# EAGLE schematic MP2565_dev_v1 (EAGLE 9.6.0)
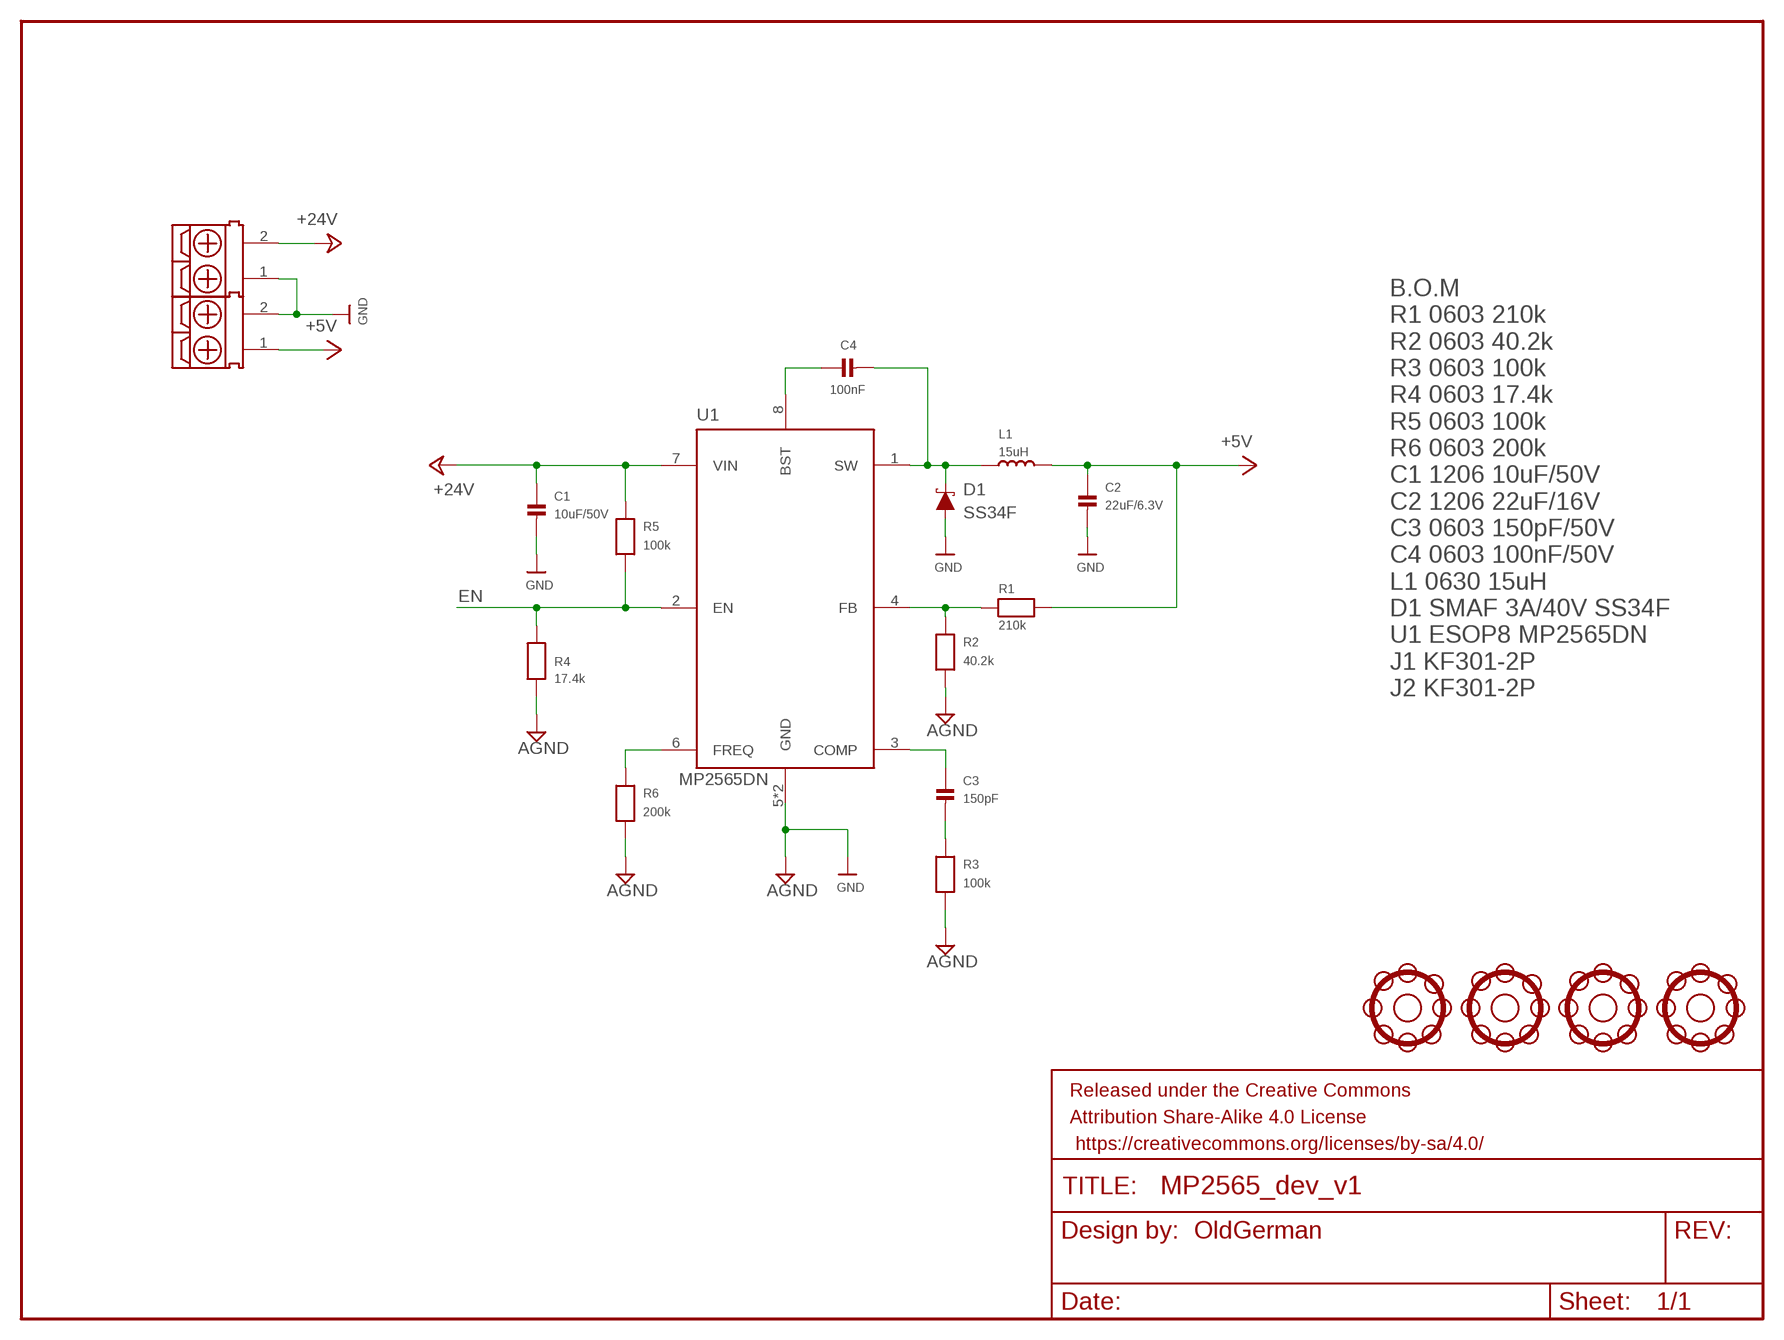
[diagram p0: schematic, sheet 1]

## Parts
C1  10uF/50V  CAP_CERAMIC1206  [1206]
C2  22uF/6.3V  CAP_CERAMIC1206  [1206]
C3  150pF  CAP_CERAMIC0603  [0603]
C4  100nF  CAP_CERAMIC0603  [0603]
D1  SS34F  [SMAF]
FRAME1  FRAME-LETTER  [CREATIVE_COMMONS]
J1  KF301_2P-5.0MM  [KF301__2P-5.0MM]
J2  KF301_2P-5.0MM  [KF301__2P-5.0MM]
L1  15uH  INDUCTOR'0630'  [L0630]
R1  210k  RESISTOR0603  [0603]
R2  40.2k  RESISTOR0603  [0603]
R3  100k  RESISTOR0603  [0603]
R4  17.4k  RESISTOR0603  [0603]
R5  100k  RESISTOR0603  [0603]
R6  200k  RESISTOR0603  [0603]
U1  MP2565DN  [ESOP8L-1.27-5X3.9MM]
U$13  SUN_HOLE_M3  [SUN_HOLE_M3]
U$14  SUN_HOLE_M3  [SUN_HOLE_M3]
U$15  SUN_HOLE_M3  [SUN_HOLE_M3]
U$16  SUN_HOLE_M3  [SUN_HOLE_M3]

## Nets
+5V: C2.1 J2.1 L1.2 R1.2
+24V: C1.1 J1.2 R5.2 U1.7(VIN)
EN: R4.1 R5.1 U1.2(EN)
GND: C1.2 C2.2 D1.A J1.1 J2.2 R2.1 R3.1 R4.2 R6.1 U1.5(GND) U1.PAD(GND) ; supply symbol labelled AGND
N$1: C4.2 D1.C L1.1 U1.1(SW)
N$2: C4.1 U1.8(BST)
N$3: R1.1 R2.2 U1.4(FB)
N$4: C3.2 R3.2
N$6: R6.2 U1.6(FREQ)
N$8: C3.1 U1.3(COMP)

## Notes on the sheet
- B.O.M
  R1 0603 210k
  R2 0603 40.2k
  R3 0603 100k
  R4 0603 17.4k
  R5 0603 100k
  R6 0603 200k
  C1 1206 10uF/50V
  C2 1206 22uF/16V
  C3 0603 150pF/50V
  C4 0603 100nF/50V
  L1 0630 15uH
  D1 SMAF 3A/40V SS34F
  U1 ESOP8 MP2565DN
  J1 KF301-2P
  J2 KF301-2P
- OldGerman

## Library data of the parts
C1-C4 = microbuilder:CAP_CERAMIC: Ceramic Capacitors 0402 - 0402 Surface Mount Capacitors 16pF 50V 5% [Digikey: 445-4899-2-ND] 18pF 50V 5% [Digikey: 490-1281-2-ND] 22pF 50V 5% [Digikey: 490-1283-2-ND] 68pF 50V 5% [Digikey: 490-1289-2-ND] 0.1uF 10V 10% [Digikey: 490-1318-2-ND] 1.0uF 6.3V 10% [Digikey: 490-1320-2-ND] 0603 - 0603 Surface Mount Capacitors 16 pF 50V 5% [Digikey: 445-5051-2-ND] 22 pF 50V [Digikey: PCC220ACVTR-ND] 33 pF 50V 5% [Digikey: 490-1415-1-ND] 56pF 50V 5% [Digikey: 490-1421-1-ND] 220pF 50V 5% [Digikey: 445-1285-1-ND] 680 pF 50V 2200 pF 50V 5% C0G [Digikey: 445-1297-1-ND] 5600 pF 100V 5% X7R [Digikey: 478-3711-1-ND] 0.1 µF 25V 10% [Digikey: PCC2277TR-ND] 0.22 µF 16V 10% X7R [Digikey: 445-1318-1-ND] 1.0 µF 25V 10% [Digikey: 445-5146-2-ND] 0603 - RF Specific 3pF 250V +/-0.1pF RF [Digikey: 712-1347-1-ND] 18 pF 250V 5% [Digikey: 478-3505-1-ND or 712-1322-1-ND] 56 pF 250V 5% C0G RF [Digikey: 490-4867-1-ND] 68 pF 250V RF [Digikey: 490-4868-1-ND] 0805 - 0805 Surface Mount Capacitors 220 pF 250V 2% RF Ceramic Capacitor [Digikey: 712-1398-1-ND] 1000 pF 50V 2% NP0 Ceramic Capacitor [Digikey: 478-3760-1-ND] 0.1 µF 25V 10% Ceramic Capacitor [Digikey: PCC1828TR-ND] 1.0 µF 16V 10% Ceramic Capacitor[Digikey: 490-1691-2-ND] 10.0 µF 10V 10% Ceramic Capacitor[Digikey: 709-1228-1-ND] 10.0 uF 16V 10% Ceramic Capacitor [Digikey: 478-5165-2-ND] 47 uF 6.3V 20% Ceramic Capacitor [Digikey: 587-1779-1-ND or 399-5506-1-ND] 1206 - 1206 Surface Mount Capacitors 47uF 10V 20% Ceramic Capacitor [Digikey: 490-5528-1-ND or 399-5508-1-ND or 445-6010-1-ND] 100uF 6.3V -20%, +80% Y5V Ceramic Capacitor (Digikey: 490-4512-1-ND, Mouser: 81-GRM31CF50J107ZE1L)
D1 = DIP:SS34F
FRAME1 = SparkFun-Aesthetics:FRAME-LETTER: Schematic Frame - Letter Standard 8.5x11 US Letter frame
J1 J2 = DIP:KF301_2P-5.0MM
L1 = DIP:INDUCTOR
R1-R6 = microbuilder:RESISTOR: Resistors 0402 - 0402 Surface Mount Package 22 Ohm 1% 1/16W [Digikey: 311-22.0LRTR-ND] 33 Ohm 5% 1/16W 1.0K 5% 1/16W 1.5K 5% 1/16W 2.0K 1% 1/16W 10.0K 1% 1/16W [Digikey: 311-10.0KLRTR-ND] 10.0K 5% 1/16W [Digikey: RMCF0402JT10K0TR-ND] 12.1K 1% 1/16W [Digikey: 311-22.0LRTR-ND] 100.0K 5% 1/16W 0603 - 0603 Surface Mount Package 0 Ohm 1/10 Watt 1% Resistor 15 Ohm 1/10 Watt 1% Resistor 33 Ohm 1/10 Watt 1% Resistor 49.9 Ohm 1/10 Watt 1% Resistor 100 Ohm 1/10 Watt 1% Resistor 150 Ohm 1/10 Watt 1% Resistor 240 Ohm 1/10 Watt 1% Resistor 390 Ohm 1/10 Watt 1% Resistor 560 Ohm 1/10 Watt 1% Resistor 680 Ohm 1/10 Watt 1% Resistor 750 Ohm 1/10 Watt 1% Resistor 1.0K Ohm 1/10 Watt 1% Resistor 1.5K Ohm 1/10 Watt 1% Resistor 2.0K Ohm 1/10 Watt 1% Resistor 2.2K Ohm 1/10 Watt 1% Resistor 3.3K Ohm 1/10 Watt 1% Resistor 4.7K Ohm 1/10 Watt 1% Resistor 10.0K Ohm 1/10 Watt 1% Resistor 12.0K Ohm 1/10 Watt 1% Resistor 12.1K Ohm 1/10 Watt 1% Resistor 20.0K Ohm 1/10 Watt 1% Resistor 33.0K Ohm 1/10 Watt 1% Resistor 100.0K Ohm 1/10 Watt 1% Resistor 0805 - 0805 Surface Mount Package 0 Ohm 1/8 Watt 1% Resistor 33 Ohm 1/8 Watt 1% Resistor 100 Ohm 1/8 Watt 1% Resistor 150 Ohm 1/8 Watt 1% Resistor 200 Ohm 1/8 Watt 1% Resistor 240 Ohm 1/8 Watt 1% Resistor 330 Ohm 1/8 Watt 1% Resistor 390 Ohm 1/8 Watt 1% Resistor 470 Ohm 1/8 Watt 1% Resistor 1.0K Ohm 1/8 Watt 1% Resistor 1.5K Ohm 1/8 Watt 1% Resistor 2.0K Ohm 1/8 Watt 1% Resistor 4.7K Ohm 1/8 Watt 1% Resistor 5.1K Ohm 1/8 Watt 1% Resistor 5.6K Ohm 1/8 Watt 1% Resistor 10.0K Ohm 1/8 Watt 1% Resistor 22.0K Ohm 1/8 Watt 1% Resistor 33.0K Ohm 1/8 Watt 1% Resistor 100K Ohm 1/8 Watt 1% Resistor 1206 - 1206 Surface Mount Package 2012 - 2010 Surface Mount Package 0.11 Ohm 1/2 Watt 1% Resistor - Digikey: RHM.11UCT-ND
U1 = DIP:MP2565DN
U$13-U$16 = DIP:SUN_HOLE_M3